# Altium schematic sheet medusa-ai-power.SchDoc
size Legal; SheetNumber: 3; SheetTotal: 5
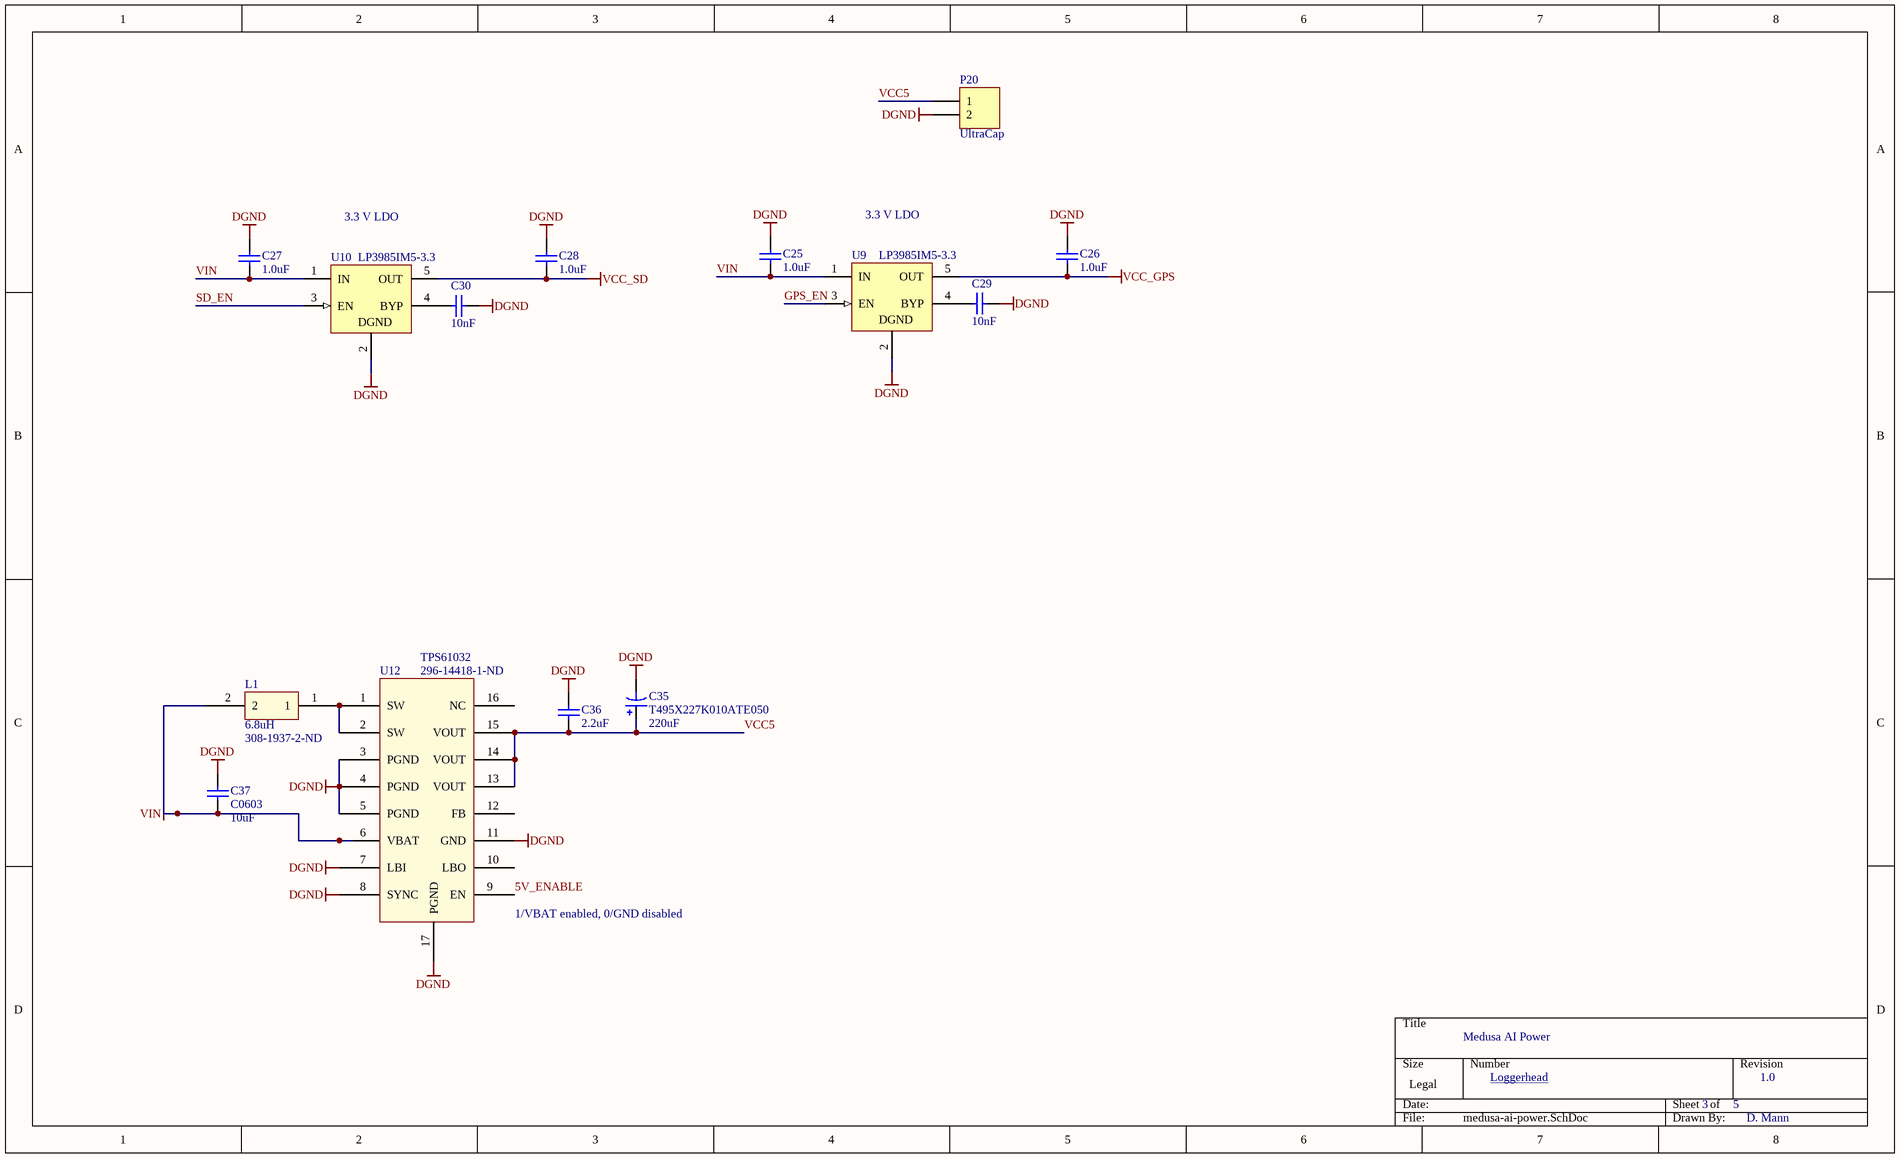
[diagram p0: medusa-ai-power.SchDoc]

## Parts
C25  1.0uF  [0402]
C26  1.0uF  [0402]
C27  1.0uF  [0402]
C28  1.0uF  [0402]
C29  10nF  [0402]
C30  10nF  [0402]
C35  T495X227K010ATE050  value 220uF  [X]
C36  2.2uF  [0402]
C37  C0603  value 10uF  [0603]
L1  6.8uH  Supplier Part Number 1: 308-1937-2-ND  [Inductor - duplicate]
P20  UltraCap  [HDR1X2]
U9  LP3985IM5-3.3  [MF05A_N]
U10  LP3985IM5-3.3  [MF05A_N]
U12  TPS61032  Supplier Part Number 2: 296-14418-1-ND  [TPS6103x]

## Nets
DGND: C25.2 C26.2 C27.2 C28.2 C29.1 C30.1 C35.2 C36.2 C37.1 P20.2 U9.2(GND) U10.2(GND) U12.3(PGND) U12.4(PGND) U12.5(PGND) U12.7(LBI) U12.8(SYNC) U12.11(GND) U12.17(PGND)
VCC_GPS: C26.1 U9.5(OUT)
VCC_SD: C28.1 U10.5(OUT)
VIN: C25.1 C27.1 C37.2 L1.2 U9.1(IN) U10.1(IN) U12.6(VBAT)
5V_ENABLE: U12.9(EN)
GPS_EN: U9.3(EN)
SD_EN: U10.3(EN)
VCC5: C35.1 C36.1 P20.1 U12.13(VOUT) U12.14(VOUT) U12.15(VOUT)
NetC29_2: C29.2 U9.4(BYP)
NetC30_2: C30.2 U10.4(BYP)
NetL1_1: L1.1 U12.1(SW) U12.2(SW)

Not connected (* = marked no-connect by the designer): U12 10(LBO) 12(FB) 16(NC)

## Notes on the sheet
- 3.3 V LDO
- (near U12) 1/VBAT enabled, 0/GND disabled
- Medusa AI Power
- Loggerhead
- 3
- 5
- 1.0
- D. Mann
- (in symbol LP3985IM5-3.3) DGND

## Library data of the parts
C25-C30 = C0402: Ceramic Chip Capacitor - Standard; Note: Footprint corresponds to dimensions for bulk cassette packaging. This case size has tightened tolerances.; Value: 0.1uF; Published: 17-Jul-2002; LatestRevisionDate: 19-Mar-2004; LatestRevisionNote: Silkscreen size reduced.; DatasheetDocument: Mar-2001; PackageDocument: Mar-2001; PackageReference: 0402; Publisher: Altium Limited; Code_JEITA: 0402; Code_IPC: 1005 [0402]; ComponentLink1Description: Manufacturer Link; ComponentLink1URL: http://www.kemet.com/; ComponentLink2Description: Datasheet; ComponentLink2URL: http://www.kemet.com/kemet/web/homepage/kechome.nsf/vapubfilesname/F3102TA.pdf/$file/F3102TA.pdf
C35 = T495X: Solid Tantalum Chip Capacitor, Standard T495 Series - Low ESR, Surge Robust; PCB_Layout: Round Glue Pad at 2.9 ±0.1mm in diameter at KEMET's option; Published: 17-Jul-2002; LatestRevisionDate: 19-Mar-2004; LatestRevisionNote: Silkscreen dimensions re-sized.; DatasheetDocument: Mar-2001; PackageDocument: Mar-2001; PackageReference: X; Publisher: Altium Limited; Code_JEITA: 7343-43; ComponentLink1Description: Manufacturer Link; ComponentLink1URL: http://www.kemet.com/; ComponentLink2Description: Datasheet; ComponentLink2URL: http://www.kemet.com/kemet/web/homepage/kechome.nsf/vapubfilesname/F3102TA.pdf/$file/F3102TA.pdf
C36 = C0402: Ceramic Chip Capacitor - Standard; Note: Footprint corresponds to dimensions for bulk cassette packaging. This case size has tightened tolerances.; Published: 17-Jul-2002; LatestRevisionDate: 19-Mar-2004; LatestRevisionNote: Silkscreen size reduced.; DatasheetDocument: Mar-2001; PackageDocument: Mar-2001; PackageReference: 0402; Publisher: Altium Limited; Code_JEITA: 0402; Code_IPC: 1005 [0402]; ComponentLink1Description: Manufacturer Link; ComponentLink1URL: http://www.kemet.com/; ComponentLink2Description: Datasheet; ComponentLink2URL: http://www.kemet.com/kemet/web/homepage/kechome.nsf/vapubfilesname/F3102TA.pdf/$file/F3102TA.pdf; Value: 2.2uF
C37 = C0603: Ceramic Chip Capacitor - Standard; Note: Footprint corresponds to dimensions for bulk cassette packaging. This case size has tightened tolerances.; Published: 17-Jul-2002; LatestRevisionDate: 19-Mar-2004; LatestRevisionNote: Silkscreen size reduced.; DatasheetDocument: Mar-2001; PackageDocument: Mar-2001; PackageReference: 0603; Publisher: Altium Limited; Code_JEITA: 0603; Code_IPC: 1608 [0603]; ComponentLink1Description: Manufacturer Link; ComponentLink1URL: http://www.kemet.com/; ComponentLink2Description: Datasheet; ComponentLink2URL: http://www.kemet.com/kemet/web/homepage/kechome.nsf/vapubfilesname/F3102TA.pdf/$file/F3102TA.pdf
L1 = Inductor 6.8uH: Sumida Inductor; Supplier 1: Digi-Key
P20 = Header 2: Header, 2-Pin; LatestRevisionDate: 17-Jul-2002; LatestRevisionNote: Re-released for DXP Platform.; Publisher: Altium Limited
U9 U10 = LP3985IM5-3.3: Micropower, 150mA Low-Noise Ultra Low-Dropout CMOS Voltage Regulator; Manufacturer: National Semiconductor; CompType: LDO IC; PackageTopMarking: LDQB*XTT; PowerWise: N; Published: 4-Dec-2008; DatasheetVersion: Aug-2005; PackageVersion: revD, Aug-2008; PackageReference: MF05A; Publisher: Altium Limited; PackageDescription: Molded SOT-23, .115 x .063 x .040 in Body, 5 Lead, .0375 in Pitch; PartNumber: LP3985IM5-3.3; RoHS: O; PinCount: 5; DigiKeyPartNumber: LP3985IM5-3.3CT-ND; ComponentLink1Description: LP3985 Datasheet; ComponentLink1URL: http://www.national.com/ds/LP/LP3985.pdf; ComponentLink2Description: LP3985 Web Page; ComponentLink2URL: http://www.national.com/pf/LP/LP3985.html; ComponentLink3Description: MF05A Package Page; ComponentLink3URL: http://www.national.com/packaging/folders/mf05a.html
U12 = TPS6103x: Boost converter; Supplier 1: Newark; Supplier 2: Digi-Key